# Altium schematic sheet interfaces.SchDoc: Jetson Xavier NX Board
size A3; PageSetup: Record=PageOptions|CenterHorizontal=True|CenterVertical=True|PrintScale=0.97|XCorrection=1.00|YCorrection=1.00|PrintKind=1|BorderSize=5000000|LeftOffset=0|BottomOffset=0|Orientation=2|PaperLength=2970|PaperWidth=2100|Scale=100|PaperSource=7|PrintQuality=600|MediaType=1|DitherType=10|PaperKind=A4|PrintScaleMode=1; Organization: Altium Limited; Address1: 3 Minna Close; Address2: Belrose; Address3: NSW 2085; Address4: Australia; Revision: Rev01
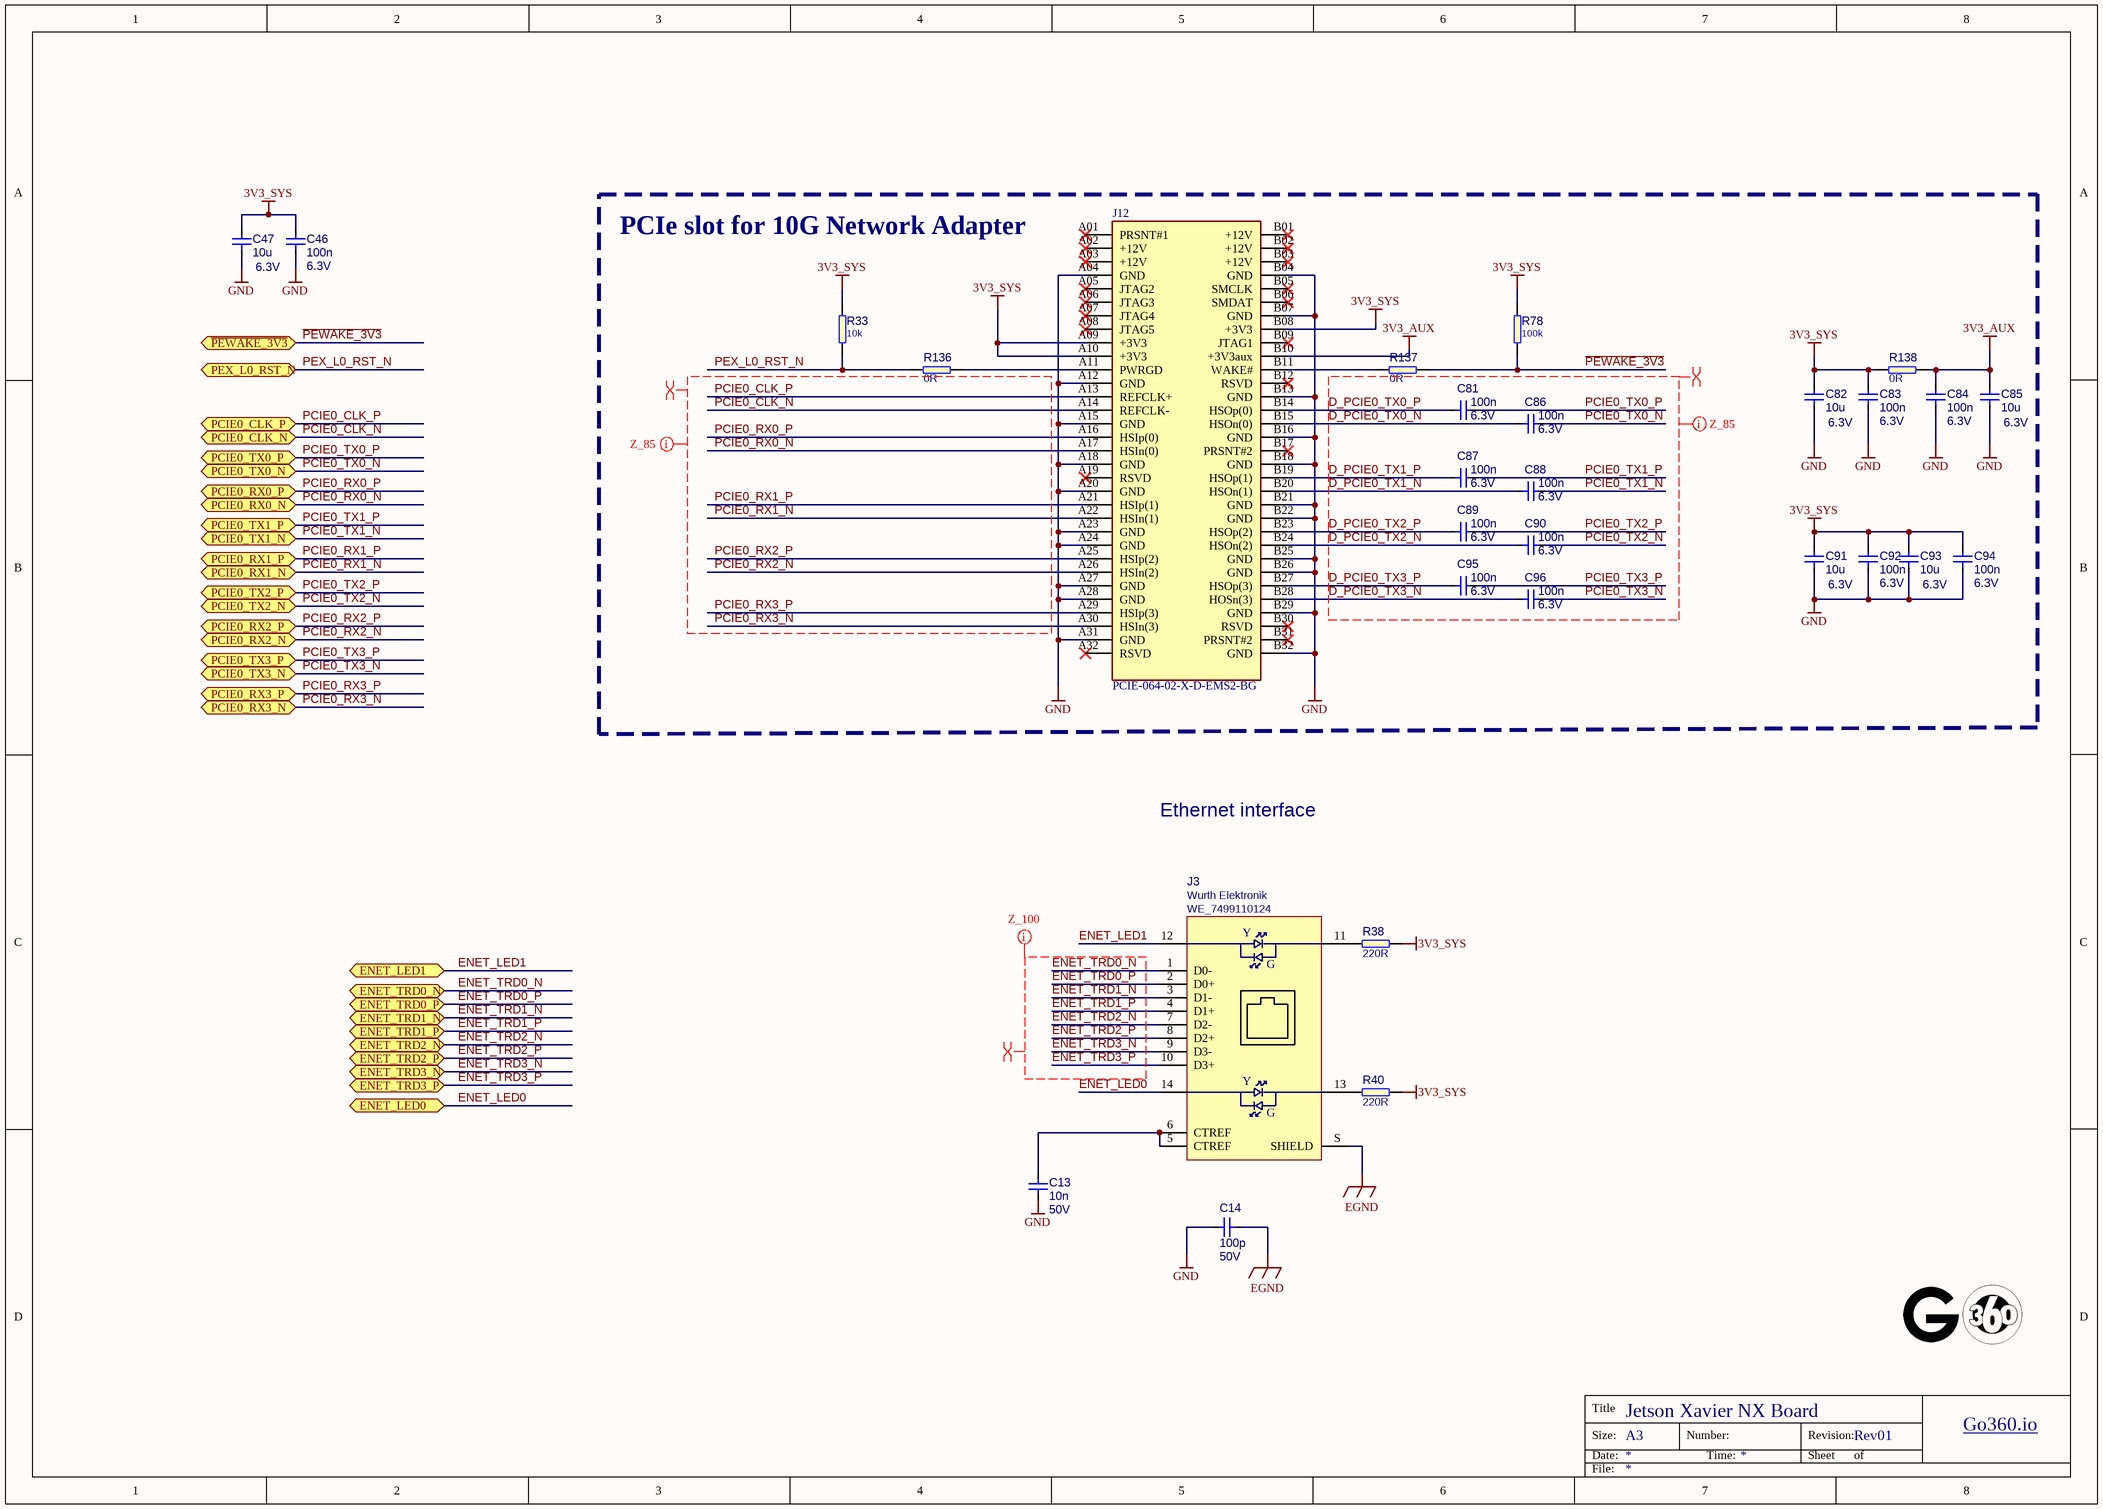
[diagram p0: interfaces.SchDoc]

## Parts
C13  Voltage: 50V  [0402]  (hidden comment: 10n)
C14  Voltage: 50V  [0805]  (hidden comment: 100p)
C46  Voltage: 6.3V  [0402]  (hidden comment: 100n)
C47  Voltage: 6.3V  [0603]  (hidden comment: 10u)
C81  Voltage: 6.3V  [0402]  (hidden comment: 100n)
C82  Voltage: 6.3V  [0603]  (hidden comment: 10u)
C83  Voltage: 6.3V  [0402]  (hidden comment: 100n)
C84  Voltage: 6.3V  [0402]  (hidden comment: 100n)
C85  Voltage: 6.3V  [0603]  (hidden comment: 10u)
C86  Voltage: 6.3V  [0402]  (hidden comment: 100n)
C87  Voltage: 6.3V  [0402]  (hidden comment: 100n)
C88  Voltage: 6.3V  [0402]  (hidden comment: 100n)
C89  Voltage: 6.3V  [0402]  (hidden comment: 100n)
C90  Voltage: 6.3V  [0402]  (hidden comment: 100n)
C91  Voltage: 6.3V  [0603]  (hidden comment: 10u)
C92  Voltage: 6.3V  [0402]  (hidden comment: 100n)
C93  Voltage: 6.3V  [0603]  (hidden comment: 10u)
C94  Voltage: 6.3V  [0402]  (hidden comment: 100n)
C95  Voltage: 6.3V  [0402]  (hidden comment: 100n)
C96  Voltage: 6.3V  [0402]  (hidden comment: 100n)
J3  Manufacturer: Wurth Elektronik  [WE_7499110124]  (hidden comment: WE_7499110124)
J12  PCIE-064-02-X-D-EMS2-BG  [SAMTEC_PCIE-064-02-X-D-EMS2-BG]
R33  10k  [0402]
R38  220R  [0402]
R40  220R  [0402]
R78  100k  [0402]
R136  0R  [0402]
R137  0R  [0402]
R138  0R  [0402]

## Blocks framed on the sheet
PCIe slot for 10G Network Adapter: C81-C96 J12 R33 R78 R136-R138

## Ports
ENET_LED0, ENET_LED1, ENET_TRD0_N, ENET_TRD0_P, ENET_TRD1_N, ENET_TRD1_P, ENET_TRD2_N, ENET_TRD2_P, ENET_TRD3_N, ENET_TRD3_P, PCIE0_CLK_N, PCIE0_CLK_P, PCIE0_RX0_N, PCIE0_RX0_P, PCIE0_RX1_N, PCIE0_RX1_P, PCIE0_RX2_N, PCIE0_RX2_P, PCIE0_RX3_N, PCIE0_RX3_P, PCIE0_TX0_N, PCIE0_TX0_P, PCIE0_TX1_N, PCIE0_TX1_P, PCIE0_TX2_N, PCIE0_TX2_P, PCIE0_TX3_N, PCIE0_TX3_P, PEX_L0_RST_N, ~{PEWAKE_3V3}

## Nets
3V3_AUX: C84.2 C85.2 J12.B10(+3V3aux) R138.1
3V3_SYS: C46.2 C47.2 C82.2 C83.2 C91.2 C92.2 C93.2 C94.2 J12.A09(+3V3) J12.A10(+3V3) J12.B08(+3V3) R33.1 R38.2 R40.1 R78.2 R138.2
EGND: C14.1 J3.S(SHIELD)
GND: C13.2 C14.2 C46.1 C47.1 C82.1 C83.1 C84.1 C85.1 C91.1 C92.1 C93.1 C94.1 J12.A04(GND) J12.A12(GND) J12.A15(GND) J12.A18(GND) J12.A20(GND) J12.A23(GND) J12.A24(GND) J12.A27(GND) J12.A28(GND) J12.A31(GND) J12.B04(GND) J12.B07(GND) J12.B13(GND) J12.B16(GND) J12.B18(GND) J12.B21(GND) J12.B22(GND) J12.B25(GND) J12.B26(GND) J12.B29(GND) J12.B32(GND)
~{PEWAKE_3V3}: R78.1 R137.1 ; port ~{PEWAKE_3V3}
D_PCIE0_TX0_N: C86.1 J12.B15(HSOn(0))
D_PCIE0_TX0_P: C81.1 J12.B14(HSOp(0))
D_PCIE0_TX1_N: C88.1 J12.B20(HSOn(1))
D_PCIE0_TX1_P: C87.1 J12.B19(HSOp(1))
D_PCIE0_TX2_N: C90.1 J12.B24(HSOn(2))
D_PCIE0_TX2_P: C89.1 J12.B23(HSOp(2))
D_PCIE0_TX3_N: C96.1 J12.B28(HOSn(3))
D_PCIE0_TX3_P: C95.1 J12.B27(HSOp(3))
ENET_LED0: J3.14 ; port ENET_LED0
ENET_LED1: J3.12 ; port ENET_LED1
ENET_TRD0_N: J3.1(D0-) ; port ENET_TRD0_N
ENET_TRD0_P: J3.2(D0+) ; port ENET_TRD0_P
ENET_TRD1_N: J3.3(D1-) ; port ENET_TRD1_N
ENET_TRD1_P: J3.4(D1+) ; port ENET_TRD1_P
ENET_TRD2_N: J3.7(D2-) ; port ENET_TRD2_N
ENET_TRD2_P: J3.8(D2+) ; port ENET_TRD2_P
ENET_TRD3_N: J3.9(D3-) ; port ENET_TRD3_N
ENET_TRD3_P: J3.10(D3+) ; port ENET_TRD3_P
PCIE0_CLK_N: J12.A14(REFCLK-) ; port PCIE0_CLK_N
PCIE0_CLK_P: J12.A13(REFCLK+) ; port PCIE0_CLK_P
PCIE0_RX0_N: J12.A17(HSIn(0)) ; port PCIE0_RX0_N
PCIE0_RX0_P: J12.A16(HSIp(0)) ; port PCIE0_RX0_P
PCIE0_RX1_N: J12.A22(HSIn(1)) ; port PCIE0_RX1_N
PCIE0_RX1_P: J12.A21(HSIp(1)) ; port PCIE0_RX1_P
PCIE0_RX2_N: J12.A26(HSIn(2)) ; port PCIE0_RX2_N
PCIE0_RX2_P: J12.A25(HSIp(2)) ; port PCIE0_RX2_P
PCIE0_RX3_N: J12.A30(HSIn(3)) ; port PCIE0_RX3_N
PCIE0_RX3_P: J12.A29(HSIp(3)) ; port PCIE0_RX3_P
PCIE0_TX0_N: C86.2 ; port PCIE0_TX0_N
PCIE0_TX0_P: C81.2 ; port PCIE0_TX0_P
PCIE0_TX1_N: C88.2 ; port PCIE0_TX1_N
PCIE0_TX1_P: C87.2 ; port PCIE0_TX1_P
PCIE0_TX2_N: C90.2 ; port PCIE0_TX2_N
PCIE0_TX2_P: C89.2 ; port PCIE0_TX2_P
PCIE0_TX3_N: C96.2 ; port PCIE0_TX3_N
PCIE0_TX3_P: C95.2 ; port PCIE0_TX3_P
PEX_L0_RST_N: R33.2 R136.2 ; port PEX_L0_RST_N
NetC13_1: C13.1 J3.5(CTREF) J3.6(CTREF)
NetJ3_11: J3.11 R38.1
NetJ3_13: J3.13 R40.2
NetJ12_A11: J12.A11(PWRGD) R136.1
NetJ12_B11: J12.B11(WAKE#) R137.2

Not connected (* = marked no-connect by the designer): J12 A01(PRSNT#1)* A02(+12V)* A03(+12V)* A05(JTAG2)* A06(JTAG3)* A07(JTAG4)* A08(JTAG5)* A19(RSVD)* A32(RSVD)* B01(+12V)* B02(+12V)* B03(+12V)* B05(SMCLK)* B06(SMDAT)* B09(JTAG1)* B12(RSVD)* B17(PRSNT#2)* B30(RSVD)* B31(PRSNT#2)*

## Layout directives
net class Z_100: ENET_TRD0_N, ENET_TRD0_P, ENET_TRD1_N, ENET_TRD1_P, ENET_TRD2_N, ENET_TRD2_P, ENET_TRD3_N, ENET_TRD3_P
differential pair: D_PCIE0_TX0_N, D_PCIE0_TX0_P, D_PCIE0_TX1_N, D_PCIE0_TX1_P, D_PCIE0_TX2_N, D_PCIE0_TX2_P, D_PCIE0_TX3_N, D_PCIE0_TX3_P, ENET_TRD0_N, ENET_TRD0_P, ENET_TRD1_N, ENET_TRD1_P, ENET_TRD2_N, ENET_TRD2_P, ENET_TRD3_N, ENET_TRD3_P, PCIE0_CLK_N, PCIE0_CLK_P, PCIE0_RX0_N, PCIE0_RX0_P, PCIE0_RX1_N, PCIE0_RX1_P, PCIE0_RX2_N, PCIE0_RX2_P, PCIE0_RX3_N, PCIE0_RX3_P, PCIE0_TX0_N, PCIE0_TX0_P, PCIE0_TX1_N, PCIE0_TX1_P, PCIE0_TX2_N, PCIE0_TX2_P, PCIE0_TX3_N, PCIE0_TX3_P
net class Z_85: D_PCIE0_TX0_N, D_PCIE0_TX0_P, D_PCIE0_TX1_N, D_PCIE0_TX1_P, D_PCIE0_TX2_N, D_PCIE0_TX2_P, D_PCIE0_TX3_N, D_PCIE0_TX3_P, PCIE0_CLK_N, PCIE0_CLK_P, PCIE0_RX0_N, PCIE0_RX0_P, PCIE0_RX1_N, PCIE0_RX1_P, PCIE0_RX2_N, PCIE0_RX2_P, PCIE0_RX3_N, PCIE0_RX3_P, PCIE0_TX0_N, PCIE0_TX0_P, PCIE0_TX1_N, PCIE0_TX1_P, PCIE0_TX2_N, PCIE0_TX2_P, PCIE0_TX3_N, PCIE0_TX3_P

## Notes on the sheet
- Ethernet interface
- Title
- Size:
- Date:
- A3
- Number:
- Time:
- Revision:
- Sheet
- of
- Go360.io
- File:
- (in symbol WE_7499111447) Y; G

## Library data of the parts
C13 = C_10n_0402: MLCC SMT Capacitor 10 nF 0402; Manufacturer: AVX; PartSymbol: 04025G103ZAT2A; PartNumber: C_10n_0402; Value: 10n
C14 = C_100p_0805: MLCC SMT Capacitor 100pF 0805; Manufacturer: AVX; PartSymbol: 08051A101JAT2A; PartNumber: C_100p_0805; Value: 100p
C46 C81 C83 C84 C86-C90 C92 C94-C96 = C_100n_0402: MLCC SMT Capacitor 100n 0402; Manufacturer: TDK; PartSymbol: C1005X5R0J104K050BA; Value: 100n; PartNumber: C_100n_0402
C47 C82 C85 C91 C93 = C_10u_0603: MLCC SMT Capacitor 10uF 0603; Manufacturer: Walsin; PartSymbol: 0603X106M6R3CT; Value: 10u; PartNumber: C_10u_0603
J3 = WE_7499111447: LAN-Transformer WE-RJ45LAN 10/100/1000 BaseT; PartNumber: WE_7499110124; Value: WE_7499110124; PartSymbol: WE_7499110124
J12 = PCIE-064-02-X-D-EMS2-BG: PCI EXPRESS EDGE MOUNT ASSEMBLY; MP: PCIE-064-02-F-D-EMS2-BG; MF: Samtec; Value: *; SnapEDA_Link: https://www.snapeda.com/parts/PCIE-064-02-F-D-EMS2-BG/Samtec/view-part/3370176/?ref=snap; Price: None; Package: None; Availability: Unavailable
R33 = R_10k_0402: RES, 10k, 0402; Manufacturer: MULTICOMP; PartSymbol: MCMR04X1002FTL; Tolerance: 1%; PartNumber: R_10k_0402; Value: 10k
R38 R40 = R_220R_0402: RES, 220R, 0402; Manufacturer: TE CONECTIVITY; PartSymbol: CRG0402J220R; PartNumber: R_220R_0402; Value: 220R
R78 = R_100k_0402: SMT Resistor 100k 0402; Manufacturer: VISHAY; PartSymbol: CRCW0402100KFKEDHP; Tolerance: 1%; PartNumber: R_100k_0402; Value: 100k
R136-R138 = R_0R_0402: RES, 0R, 0402; Manufacturer: Panasonic; PartSymbol: ERJ2GE0R00X; Value: 0R; PartNumber: R_0R_0402